# EasyEDA Pro project OpenArt拓展板v1.4.eprj

# Schematic Schematic1
Create Date: 2023-12-01; Page Name: P1; Project Name: OpenArt拓展板v1.4; Schematic Name: Schematic1; Update Date: 2024-03-08; Company: 嘉立创EDA; Page Size: A4; Version: V1.0
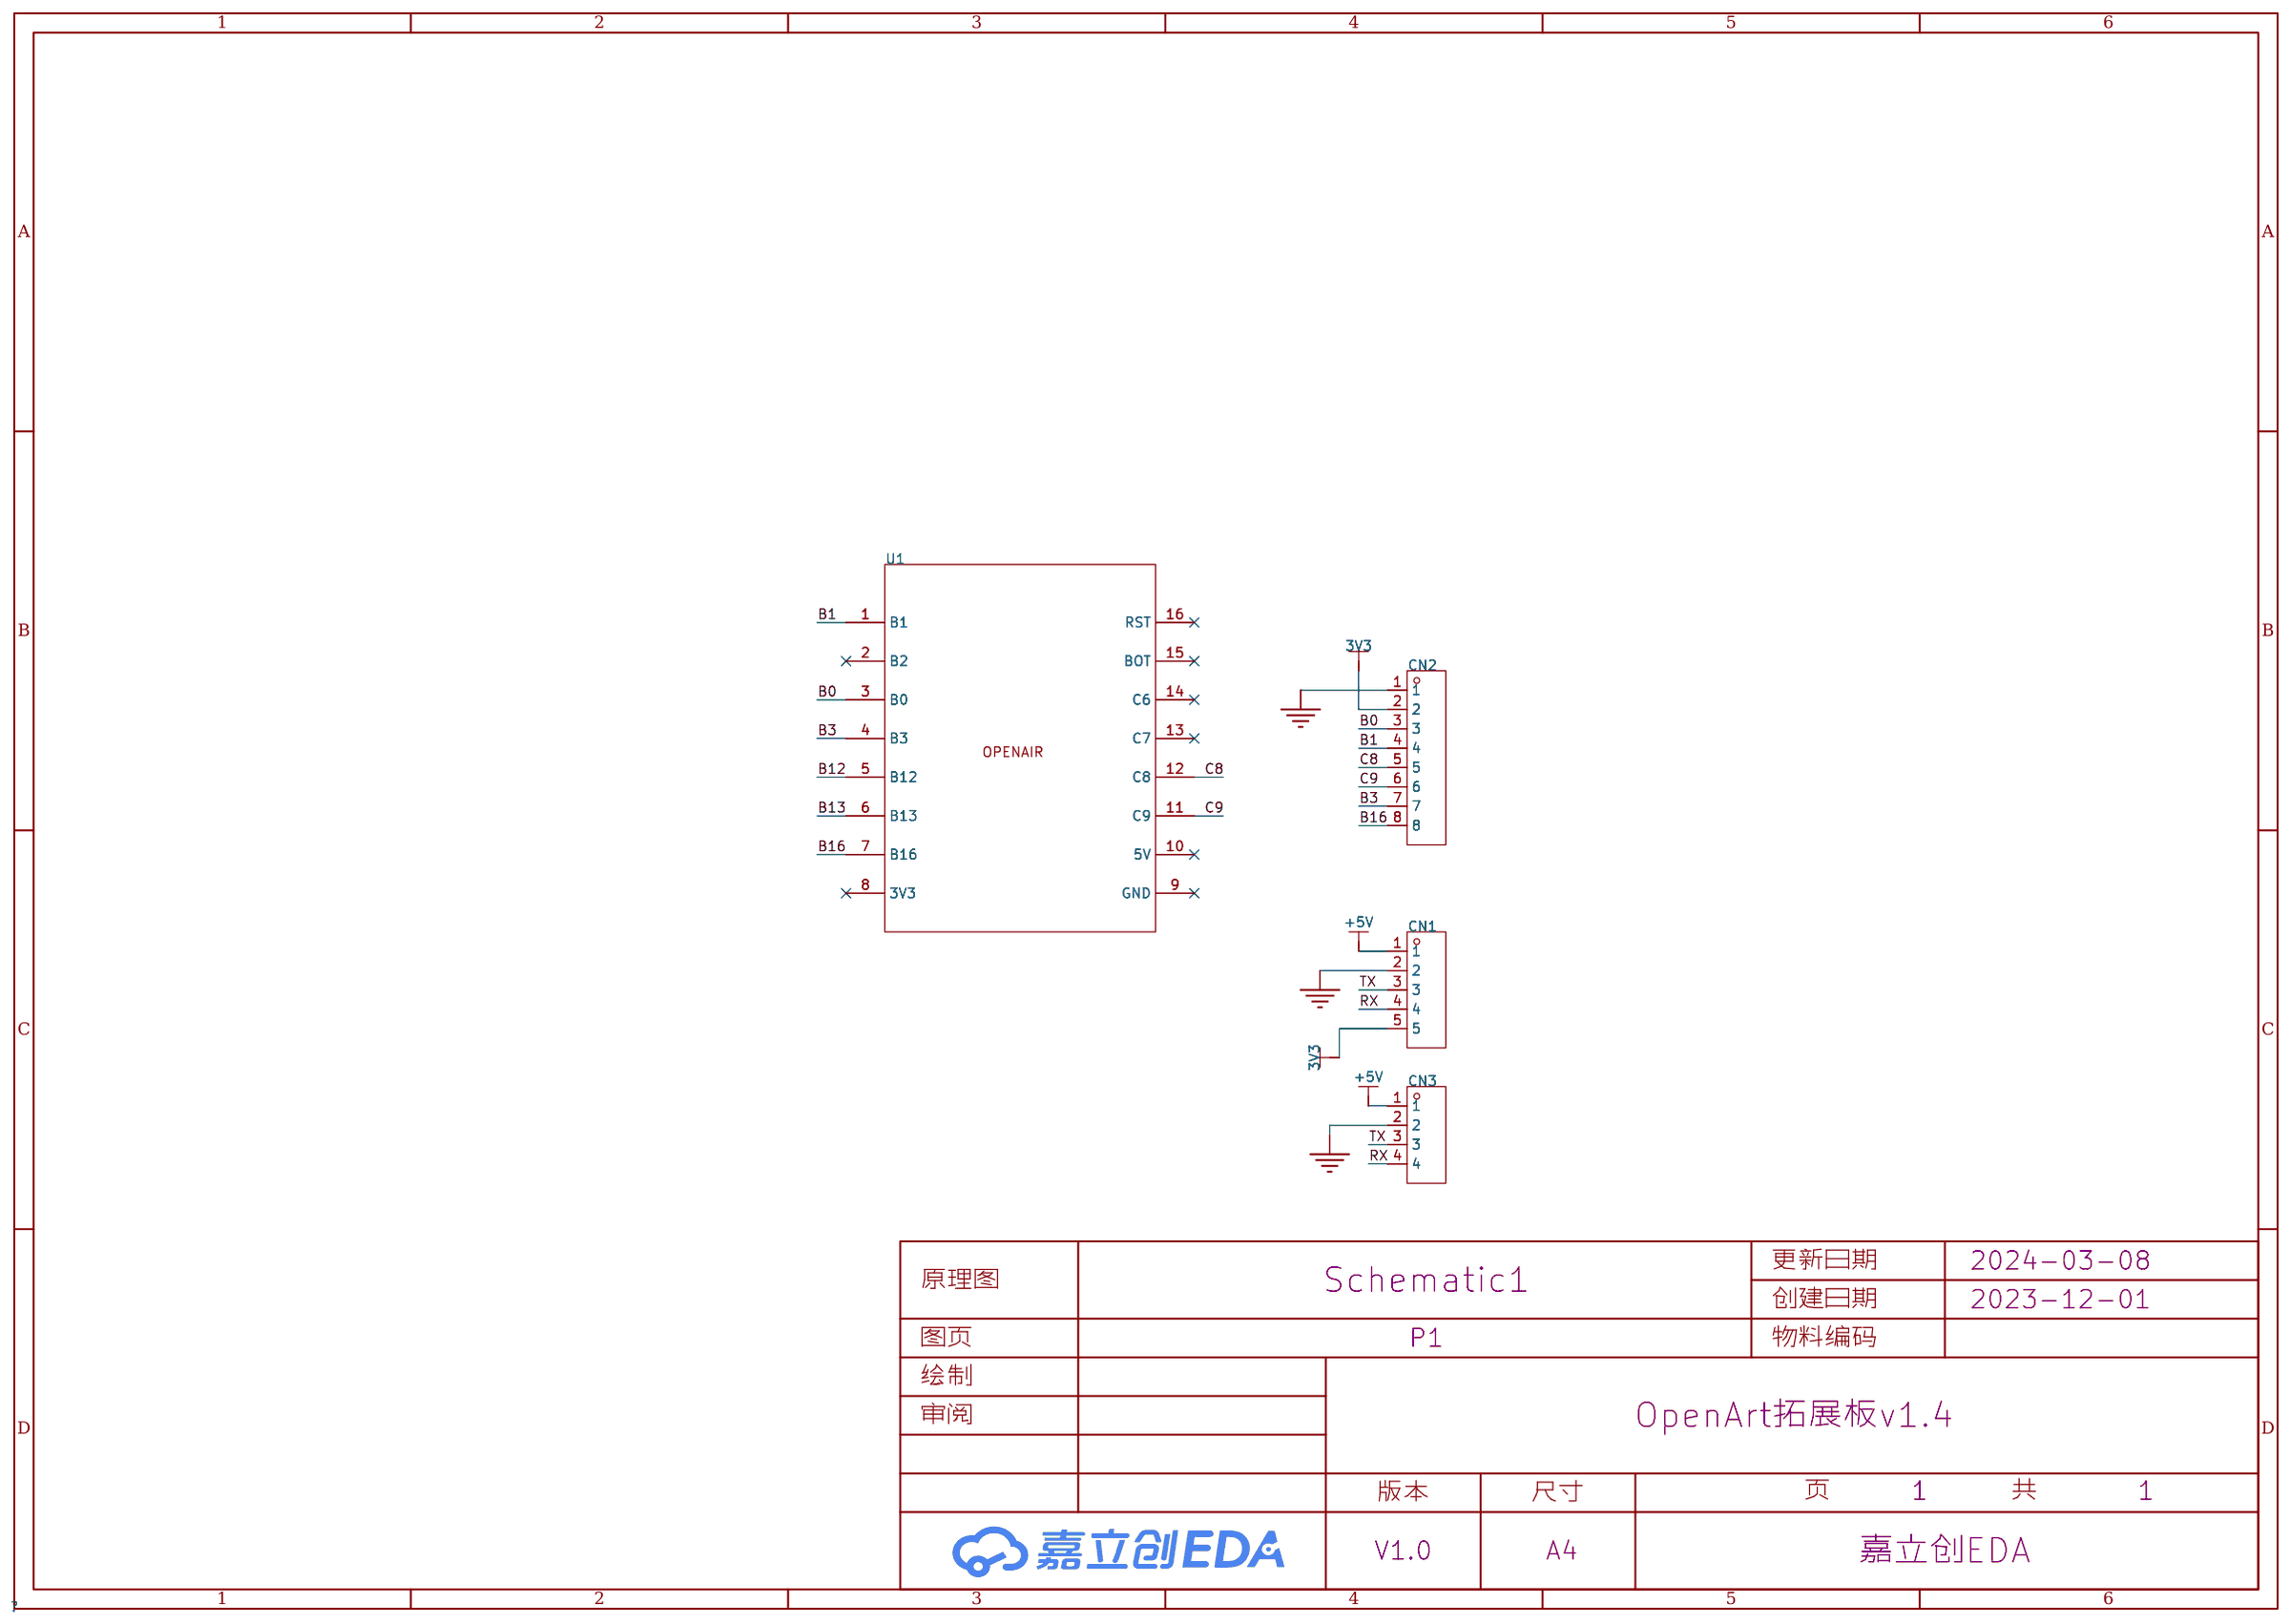
[diagram p0: schematic sheet]

## Parts
CN1  ZX-HA2.54-5PWZ  [CONN-TH_5P-P2.50_ZX-HA2.54-5PWZ]
CN2  BX-XH2.54-8PZZ  [CONN-TH_8P-P2.50_BX-XH2.54-8PZZ]
CN3  ZX-XH2.54-4PWZ  [CONN-TH_4P-P2.50_ZX-XH2.54-4PWZ]
U1  -  [OPENAIR]

## Library data of the parts
CN1 = ZX-HA2.54-5PWZ: 插针结构:1x5P;间距:2.54mm;安装方式:弯插;参考系列:XH;总PIN数:5P;排数:1;每排PIN数:5;行距:-;额定电流:3A;触头材质:黄铜;触头镀层:锡;工作温度范围:-25℃~+85℃;; LCSC Part Name: 1x5P 间距:2.54mm 弯插 系列:XH/HA带扣; Supplier Part: C7429626; Manufacturer: Megastar(兆星); Supplier Footprint: 弯插,P=2.54mm; JLCPCB Part Class: 扩展库; Datasheet: https://atta.szlcsc.com/upload/public/pdf/source/20230619/9F9409DD07EAA554DDDE11B7E7BFEFE1.pdf; Supplier: LCSC; Pins Structure: 1x5P; Pitch: 2.54mm; Mounting Style: 弯插; Reference Series: XH; Number of Pins: 5P; Number of Rows: 1; Number of PINs Per Row: 5; Current Rating (Max): 3A; Contact Material: 黄铜; Contact Plating: 锡; Operating Temperature Range: -25℃~+85℃
CN2 = BX-XH2.54-8PZZ: 插针结构:1x8P;间距:2.54mm;安装方式:直插;参考系列:XH;总PIN数:8P;排数:1;每排PIN数:8;行距:-;额定电流:3A;触头材质:黄铜;触头镀层:锡;工作温度范围:-25℃~+85℃;; Supplier Part: C18077839; Manufacturer: Bossie(博锡); Supplier Footprint: 插件,P=2.54mm; JLCPCB Part Class: 扩展库; Datasheet: https://atta.szlcsc.com/upload/public/pdf/source/20231017/CBB233C5B4BF7FAD492668A18B6464FA.pdf; Supplier: LCSC; Pins Structure: 1x8P; Pitch: 2.54mm; Mounting Style: 直插; Reference Series: XH; Number of Pins: 8P; Number of Rows: 1; Number of PINs Per Row: 8; Current Rating (Max): 3A; Contact Material: 黄铜; Contact Plating: 锡; Operating Temperature Range: -25℃~+85℃
CN3 = ZX-XH2.54-4PWZ: 插针结构:1x4P;间距:2.54mm;安装方式:弯插;参考系列:XH;总PIN数:4P;排数:1;每排PIN数:4;行距:-;额定电流:3A;触头材质:黄铜;触头镀层:锡;工作温度范围:-25℃~+85℃;; Supplier Part: C7429643; Manufacturer: Megastar(兆星); Supplier Footprint: 弯插,P=2.54mm; JLCPCB Part Class: 扩展库; Datasheet: https://atta.szlcsc.com/upload/public/pdf/source/20230619/8DC602C7BA46C153FF1BE89D90453879.pdf; Supplier: LCSC; Pins Structure: 1x4P; Pitch: 2.54mm; Mounting Style: 弯插; Reference Series: XH; Number of Pins: 4P; Number of Rows: 1; Number of PINs Per Row: 4; Current Rating (Max): 3A; Contact Material: 黄铜; Contact Plating: 锡; Operating Temperature Range: -25℃~+85℃
U1 = OPENAIR

## Nets
3V3: CN1.5 CN2.2
+5V: CN1.1 CN3.1
GND: CN1.2 CN2.1 CN3.2
B0: CN2.3 U1.3(B0)
B1: CN2.4 U1.1(B1)
B3: CN2.7 U1.4(B3)
B12: U1.5(B12)
B13: U1.6(B13)
B16: CN2.8 U1.7(B16)
C8: CN2.5 U1.12(C8)
C9: CN2.6 U1.11(C9)
RX: CN1.4 CN3.4
TX: CN1.3 CN3.3

Not connected (* = marked no-connect by the designer): U1 2(B2)* 8(3V3)* 9(GND)* 10(5V)* 13(C7)* 14(C6)* 15(BOT)* 16(RST)*

# Board PCB1
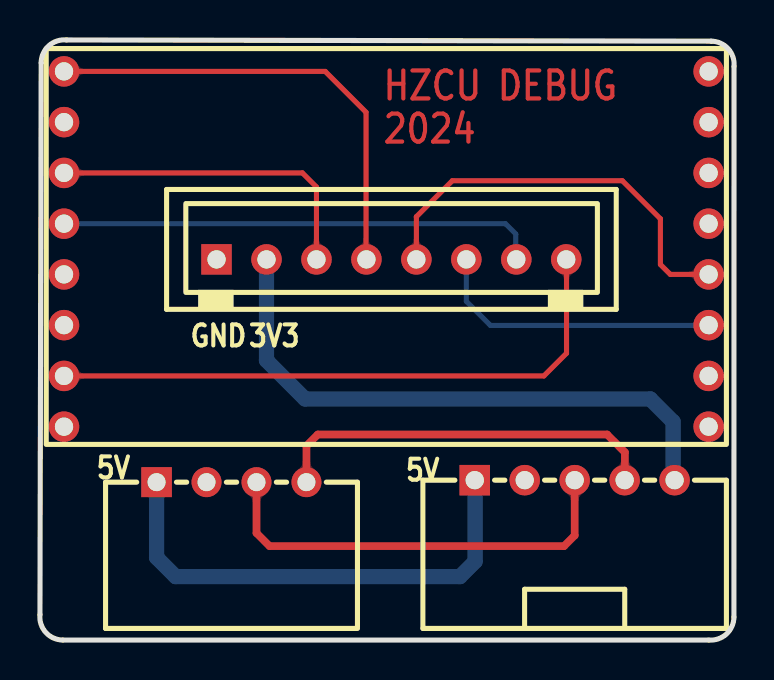
[diagram p1: board, top side]
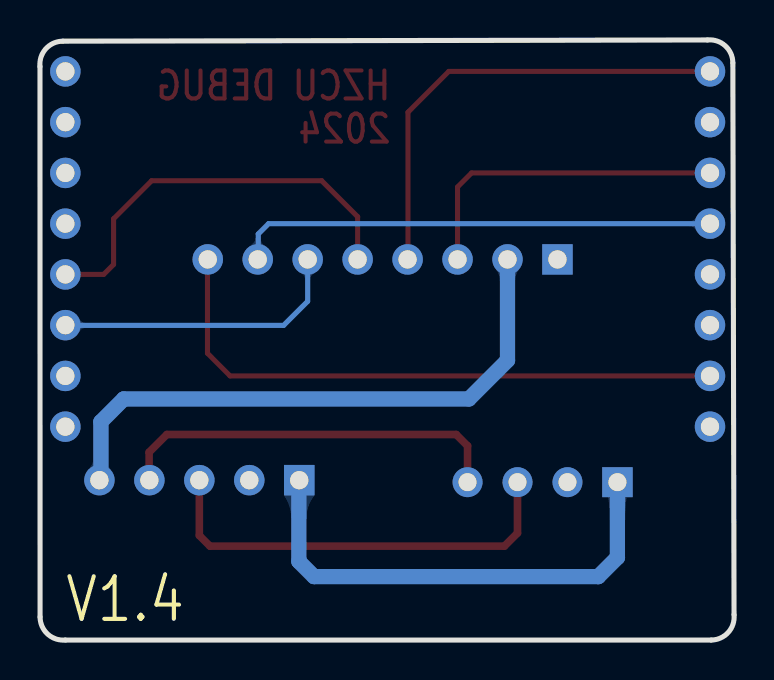
[diagram p2: board, bottom side, seen from below]

Outline 34.73 x 30.03 mm; copper layers: Top Layer, Bottom Layer. Coordinates in mm from the lower left corner of the outline.
Outline path: 0,1.27 0.06,28.89 arc(0.44,29.74) 1.33,30.03 33.59,29.97 arc(34.44,29.59) 34.73,28.7 34.73,1.16 arc(34.35,0.3) 33.46,0 1.14,0 arc(0.29,0.38) 0,1.27
Stack: Top Layer 0.035mm / Dielectric1 1.51mm FR4 er 4.5 / Bottom Layer 0.035mm

## Design rules (mm)
template: JLCPCB Capability(Two Layers Board)
spacing copperThickness1oz (default): track to track 0.102, other pairs 0.152 to 0.3
spacing copperThickness2oz: track to track 0.203, other pairs 0.152 to 0.3
track width copperThickness1oz (default): min 0.127, default 0.254, max 2.54
track width copperThickness2oz: min 0.203, default 0.254, max 2.54
differential pair differentialPair (default): width min 0.127, default 0.254, max 2.54; gap min 0.152, default 0.152
via viaSize (default): diameter min 0.5, default 0.61, max 10; hole min 0.3, default 0.305, max 6.3

## Placement (name value [footprint] x y rotation side)
CN1  ZX-HA2.54-5PWZ  [CONN-TH_5P-P2.50_ZX-HA2.54-5PWZ]  26.76 8 0 top
CN2  BX-XH2.54-8PZZ  [CONN-TH_8P-P2.50_BX-XH2.54-8PZZ]  17.59 19.05 0 top
CN3  ZX-XH2.54-4PWZ  [CONN-TH_4P-P2.50_ZX-XH2.54-4PWZ]  9.59 7.9 0 top
U1  -  [OPENAIR]  1.2 10.68 0 top

## Footprints (pads in the part's own frame, mm; a bottom-side part is the same pattern mirrored in y, then rotated)
CONN-TH_4P-P2.50_ZX-XH2.54-4PWZ
  rect 1.524x1.5 hole 0.9: 1(-3.75,0)
  round 1.5 hole 0.9: 2(-1.25,0) 3(1.25,0) 4(3.75,0)
CONN-TH_5P-P2.50_ZX-HA2.54-5PWZ
  rect 1.524x1.524 hole 0.914: 1(-5,0)
  round 1.524 hole 0.914: 2(-2.5,0) 3(0,0) 4(2.5,0) 5(5,0)
CONN-TH_8P-P2.50_BX-XH2.54-8PZZ
  rect 1.524x1.524 hole 0.914: 1(-8.75,0)
  round 1.524 hole 0.914: 2(-6.25,0) 3(-3.75,0) 4(-1.25,0) 5(1.25,0) 6(3.75,0) 7(6.25,0) 8(8.75,0)
OPENAIR
  round 1.524 hole 0.914: 1(0,17.78) 2(0,15.24) 3(0,12.7) 4(0,10.16) 5(0,7.62) 6(0,5.08) 7(0,2.54) 8(0,0) 9(32.258,0) 10(32.258,2.54) 11(32.258,5.08) 12(32.258,7.62) 13(32.258,10.16) 14(32.258,12.7) 15(32.258,15.24) 16(32.258,17.78)

## Nets
As in the schematic.

Pads without a net: U1 2 8 9 10 13 14 15 16

## Routing (per net, layer and track width the routed paths; a pad name or vN(x,y) marks a point on that pad's centre or on a via; arc(x,y) is an arc through that point)
3V3: length 29.6
  Bottom Layer w0.762: CN1.5 31.68,8.08 31.68,10.92 30.54,12.07 13.27,12.07 11.34,14 CN2.2
+5V: length 24.5
  Bottom Layer w0.762: CN1.1 21.78,7.98 21.78,3.94 21.02,3.18 6.79,3.18 5.84,4.13 CN3.1
B0: length 16.5
  Top Layer w0.254: U1.3 13.13,23.38 13.84,22.67 CN2.3
B1: length 23.3
  Top Layer w0.254: CN2.4 16.32,19.07 16.32,26.42 14.27,28.46 U1.1
B3: length 24.1
  Bottom Layer w0.254: U1.4 23.29,20.84 23.81,20.32 23.81,19.08 CN2.7
B16: length 30.3
  Top Layer w0.254: U1.7 25.22,13.22 26.35,14.35 26.35,19.04 CN2.8
C8: length 20.8
  Top Layer w0.254: U1.12 31.55,18.3 31.05,18.8 31.05,21.08 29.14,22.99 20.63,22.99 18.84,21.19 CN2.5
C9: length 14.7
  Bottom Layer w0.254: U1.11 33.45,15.75 22.54,15.75 21.34,16.95 CN2.6
RX: length 19.8
  Top Layer w0.381: CN3.4 13.34,9.72 13.9,10.29 28.38,10.29 29.27,9.4 29.27,8.01 CN1.4
TX: length 21.7
  Top Layer w0.381: CN1.3 26.76,5.23 26.22,4.7 11.49,4.7 10.84,5.35 CN3.3

## Copper pours and planes (outline as drawn; the poured copper is in the pictures)
GND on Top Layer: -2.1,32.39 36.26,32.39 36.26,-1.52 -2.1,-1.52
GND on Bottom Layer: -2.1,32.39 36.26,32.39 36.26,-1.52 -2.1,-1.52

Small or netless copper shapes (teardrops, artwork), in the pictures only: 12 on Top Layer, 8 on Bottom Layer

## Text on the board
Bottom Silkscreen Layer: V1.4
Top Layer: HZCU | 2024 | DEBUG
Top Solder Mask Layer: HZCU | 2024 | DEBUG
Top Silkscreen Layer: 5V | GND | 3V3
